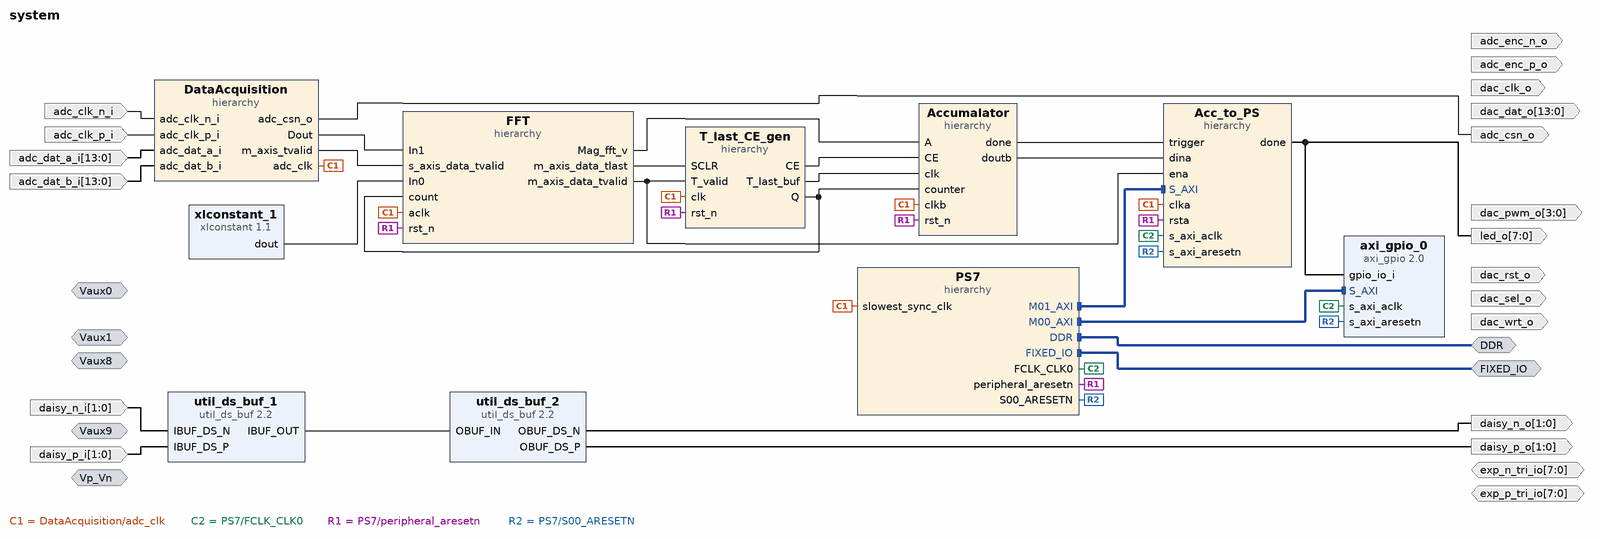
[diagram p0: block diagram of the top level]
# Vivado block design system, xc7z010clg400-1, Vivado 2024.2
create_bd_design system

create_bd_intf_port -mode Slave -vlnv xilinx.com:interface:diff_analog_io_rtl:1.0 Vp_Vn
create_bd_intf_port -mode Slave -vlnv xilinx.com:interface:diff_analog_io_rtl:1.0 Vaux0
create_bd_intf_port -mode Slave -vlnv xilinx.com:interface:diff_analog_io_rtl:1.0 Vaux1
create_bd_intf_port -mode Slave -vlnv xilinx.com:interface:diff_analog_io_rtl:1.0 Vaux9
create_bd_intf_port -mode Slave -vlnv xilinx.com:interface:diff_analog_io_rtl:1.0 Vaux8
create_bd_intf_port -mode Master -vlnv xilinx.com:interface:ddrx_rtl:1.0 DDR
create_bd_intf_port -mode Master -vlnv xilinx.com:display_processing_system7:fixedio_rtl:1.0 FIXED_IO
create_bd_port -dir I -from 13 -to 0 adc_dat_a_i
create_bd_port -dir I -from 13 -to 0 adc_dat_b_i
create_bd_port -dir I adc_clk_p_i
create_bd_port -dir I adc_clk_n_i
create_bd_port -dir O adc_enc_p_o
create_bd_port -dir O adc_enc_n_o
create_bd_port -dir O adc_csn_o
create_bd_port -dir O -from 13 -to 0 dac_dat_o
create_bd_port -dir O dac_clk_o
create_bd_port -dir O dac_rst_o
create_bd_port -dir O dac_sel_o
create_bd_port -dir O dac_wrt_o
create_bd_port -dir O -from 3 -to 0 dac_pwm_o
create_bd_port -dir IO -from 7 -to 0 exp_p_tri_io
create_bd_port -dir IO -from 7 -to 0 exp_n_tri_io
create_bd_port -dir O -from 1 -to 0 daisy_p_o
create_bd_port -dir O -from 1 -to 0 daisy_n_o
create_bd_port -dir I -from 1 -to 0 daisy_p_i
create_bd_port -dir I -from 1 -to 0 daisy_n_i
create_bd_port -dir O -from 7 -to 0 led_o

create_bd_cell -type ip -vlnv xilinx.com:ip:util_ds_buf:2.2 util_ds_buf_1
set_property -dict {CONFIG.C_SIZE 2} [get_bd_cells util_ds_buf_1]
create_bd_cell -type ip -vlnv xilinx.com:ip:util_ds_buf:2.2 util_ds_buf_2
set_property -dict {CONFIG.C_BUF_TYPE OBUFDS CONFIG.C_SIZE 2} [get_bd_cells util_ds_buf_2]
create_bd_cell -type hier PS7
create_bd_cell -type hier DataAcquisition
create_bd_cell -type ip -vlnv xilinx.com:ip:axi_gpio:2.0 axi_gpio_0
set_property -dict {CONFIG.C_ALL_INPUTS 1 CONFIG.C_GPIO_WIDTH 32 CONFIG.C_IS_DUAL 0} [get_bd_cells axi_gpio_0]
create_bd_cell -type ip -vlnv xilinx.com:ip:xlconstant:1.1 xlconstant_1
set_property -dict {CONFIG.CONST_VAL 0 CONFIG.CONST_WIDTH 16} [get_bd_cells xlconstant_1]
create_bd_cell -type hier FFT
create_bd_cell -type hier T_last_CE_gen
create_bd_cell -type hier Accumalator
create_bd_cell -type hier Acc_to_PS

# ---- hierarchy /PS7 ----
current_bd_instance /PS7
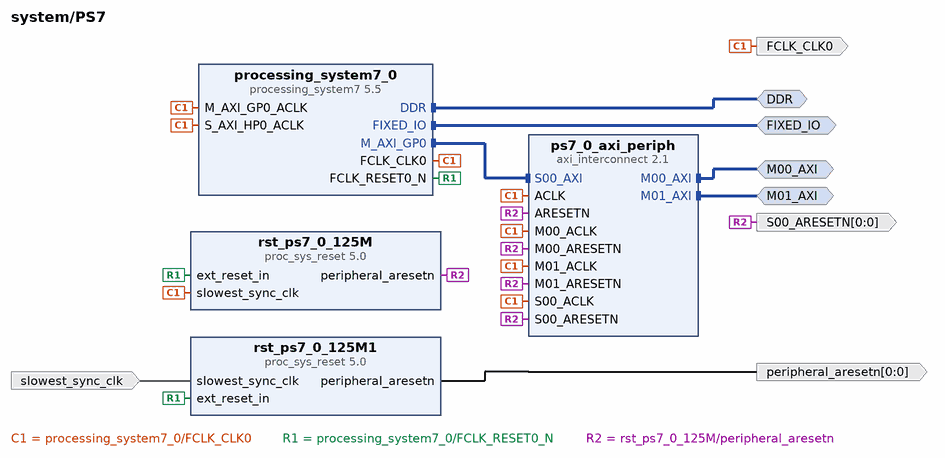
[diagram p1: block diagram inside /PS7]
create_bd_intf_pin -mode Master -vlnv xilinx.com:interface:ddrx_rtl:1.0 DDR
create_bd_intf_pin -mode Master -vlnv xilinx.com:display_processing_system7:fixedio_rtl:1.0 FIXED_IO
create_bd_intf_pin -mode Master -vlnv xilinx.com:interface:aximm_rtl:1.0 M00_AXI
create_bd_intf_pin -mode Master -vlnv xilinx.com:interface:aximm_rtl:1.0 M01_AXI
create_bd_pin -dir O -type clk FCLK_CLK0
create_bd_pin -dir O -from 0 -to 0 -type rst S00_ARESETN
create_bd_pin -dir I -type clk slowest_sync_clk
create_bd_pin -dir O -from 0 -to 0 -type rst peripheral_aresetn

create_bd_cell -type ip -vlnv xilinx.com:ip:processing_system7:5.5 processing_system7_0
set_property -dict [list \
  CONFIG.PCW_APU_PERIPHERAL_FREQMHZ 666.666666 \
  CONFIG.PCW_ENET0_ENET0_IO {MIO 16 .. 27} \
  CONFIG.PCW_ENET0_GRP_MDIO_ENABLE 1 \
  CONFIG.PCW_ENET0_GRP_MDIO_IO EMIO \
  CONFIG.PCW_ENET0_PERIPHERAL_ENABLE 1 \
  CONFIG.PCW_ENET0_RESET_ENABLE 0 \
  CONFIG.PCW_ENET_RESET_ENABLE 1 \
  CONFIG.PCW_ENET_RESET_SELECT {Share reset pin} \
  CONFIG.PCW_FPGA0_PERIPHERAL_FREQMHZ 125 \
  CONFIG.PCW_FPGA1_PERIPHERAL_FREQMHZ 250 \
  CONFIG.PCW_FPGA3_PERIPHERAL_FREQMHZ 200 \
  CONFIG.PCW_GPIO_MIO_GPIO_ENABLE 1 \
  CONFIG.PCW_GPIO_MIO_GPIO_IO MIO \
  CONFIG.PCW_GPIO_PERIPHERAL_ENABLE 1 \
  CONFIG.PCW_I2C0_GRP_INT_ENABLE 0 \
  CONFIG.PCW_I2C0_I2C0_IO {MIO 50 .. 51} \
  CONFIG.PCW_I2C0_PERIPHERAL_ENABLE 1 \
  CONFIG.PCW_I2C_PERIPHERAL_FREQMHZ 111.111115 \
  CONFIG.PCW_I2C_RESET_ENABLE 1 \
  CONFIG.PCW_I2C_RESET_SELECT {Share reset pin} \
  CONFIG.PCW_IMPORT_BOARD_PRESET cfg/red_pitaya.xml \
  CONFIG.PCW_PRESET_BANK1_VOLTAGE {LVCMOS 2.5V} \
  CONFIG.PCW_QSPI_GRP_SINGLE_SS_ENABLE 1 \
  CONFIG.PCW_QSPI_GRP_SINGLE_SS_IO {MIO 1 .. 6} \
  CONFIG.PCW_QSPI_PERIPHERAL_ENABLE 1 \
  CONFIG.PCW_QSPI_PERIPHERAL_FREQMHZ 125 \
  CONFIG.PCW_QSPI_QSPI_IO {MIO 1 .. 6} \
  CONFIG.PCW_SD0_GRP_CD_ENABLE 1 \
  CONFIG.PCW_SD0_GRP_CD_IO {MIO 46} \
  CONFIG.PCW_SD0_GRP_WP_ENABLE 1 \
  CONFIG.PCW_SD0_GRP_WP_IO {MIO 47} \
  CONFIG.PCW_SD0_PERIPHERAL_ENABLE 1 \
  CONFIG.PCW_SD0_SD0_IO {MIO 40 .. 45} \
  CONFIG.PCW_SDIO_PERIPHERAL_FREQMHZ 100 \
  CONFIG.PCW_SINGLE_QSPI_DATA_MODE x4 \
  CONFIG.PCW_SPI0_PERIPHERAL_ENABLE 1 \
  CONFIG.PCW_SPI0_SPI0_IO EMIO \
  CONFIG.PCW_SPI1_PERIPHERAL_ENABLE 1 \
  CONFIG.PCW_SPI1_SPI1_IO {MIO 10 .. 15} \
  CONFIG.PCW_TTC0_PERIPHERAL_ENABLE 1 \
  CONFIG.PCW_TTC0_TTC0_IO EMIO \
  CONFIG.PCW_UART0_PERIPHERAL_ENABLE 1 \
  CONFIG.PCW_UART0_UART0_IO {MIO 14 .. 15} \
  CONFIG.PCW_UART1_PERIPHERAL_ENABLE 1 \
  CONFIG.PCW_UART1_UART1_IO {MIO 8 .. 9} \
  CONFIG.PCW_UART_PERIPHERAL_FREQMHZ 100 \
  CONFIG.PCW_UIPARAM_DDR_BUS_WIDTH {16 Bit} \
  CONFIG.PCW_UIPARAM_DDR_FREQ_MHZ 533.333333 \
  CONFIG.PCW_UIPARAM_DDR_PARTNO {MT41J256M16 RE-125} \
  CONFIG.PCW_USB0_PERIPHERAL_ENABLE 1 \
  CONFIG.PCW_USB0_RESET_ENABLE 1 \
  CONFIG.PCW_USB0_RESET_IO {MIO 48} \
  CONFIG.PCW_USB0_USB0_IO {MIO 28 .. 39} \
  CONFIG.PCW_USB_RESET_ENABLE 1 \
  CONFIG.PCW_USB_RESET_SELECT {Share reset pin} \
  CONFIG.PCW_USE_S_AXI_HP0 1 \
] [get_bd_cells processing_system7_0]
# 429 more settings of processing_system7_0 are not shown: defaults, MIO pin electricals, DDR timing, and values the tool derives
create_bd_cell -type ip -vlnv xilinx.com:ip:proc_sys_reset:5.0 rst_ps7_0_125M
create_bd_cell -type ip -vlnv xilinx.com:ip:axi_interconnect:2.1 ps7_0_axi_periph
set_property -dict {CONFIG.NUM_MI 2} [get_bd_cells ps7_0_axi_periph]
create_bd_cell -type ip -vlnv xilinx.com:ip:proc_sys_reset:5.0 rst_ps7_0_125M1

# ---- hierarchy /DataAcquisition ----
current_bd_instance /DataAcquisition
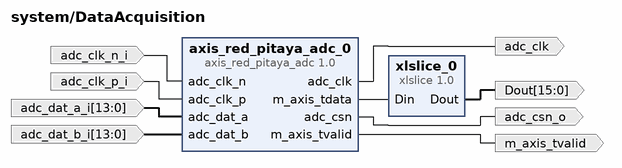
[diagram p2: block diagram inside /DataAcquisition]
create_bd_pin -dir O -type clk adc_clk
create_bd_pin -dir O adc_csn_o
create_bd_pin -dir I adc_clk_p_i
create_bd_pin -dir I adc_clk_n_i
create_bd_pin -dir I -from 13 -to 0 adc_dat_a_i
create_bd_pin -dir I -from 13 -to 0 adc_dat_b_i
create_bd_pin -dir O m_axis_tvalid
create_bd_pin -dir O -from 15 -to 0 Dout

create_bd_cell -type ip -vlnv pavel-demin:user:axis_red_pitaya_adc:1.0 axis_red_pitaya_adc_0
create_bd_cell -type ip -vlnv xilinx.com:ip:xlslice:1.0 xlslice_0
set_property -dict {CONFIG.DIN_FROM 15} [get_bd_cells xlslice_0]

# ---- hierarchy /FFT ----
current_bd_instance /FFT
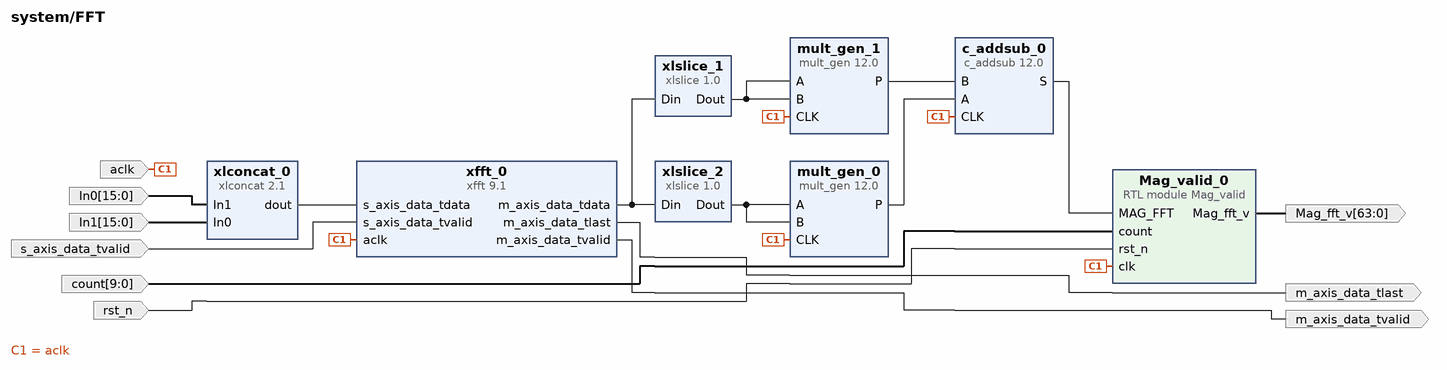
[diagram p3: block diagram inside /FFT]
create_bd_pin -dir I -type clk aclk
create_bd_pin -dir O m_axis_data_tvalid
create_bd_pin -dir O m_axis_data_tlast
create_bd_pin -dir I -from 15 -to 0 In0
create_bd_pin -dir I -type rst rst_n
create_bd_pin -dir I -from 9 -to 0 count
create_bd_pin -dir O -from 63 -to 0 Mag_fft_v
create_bd_pin -dir I s_axis_data_tvalid
create_bd_pin -dir I -from 15 -to 0 In1

create_bd_cell -type ip -vlnv xilinx.com:ip:c_addsub:12.0 c_addsub_0
set_property -dict [list \
  CONFIG.A_Width 64 \
  CONFIG.B_Value 0000000000000000000000000000000000000000000000000000000000000000 \
  CONFIG.B_Width 64 \
  CONFIG.CE false \
  CONFIG.Implementation Fabric \
  CONFIG.Latency 1 \
  CONFIG.Out_Width 64 \
] [get_bd_cells c_addsub_0]
create_bd_cell -type ip -vlnv xilinx.com:ip:mult_gen:12.0 mult_gen_0
set_property -dict [list \
  CONFIG.Multiplier_Construction Use_Mults \
  CONFIG.PortAType Signed \
  CONFIG.PortAWidth 32 \
  CONFIG.PortBType Signed \
  CONFIG.PortBWidth 32 \
] [get_bd_cells mult_gen_0]
create_bd_cell -type ip -vlnv xilinx.com:ip:mult_gen:12.0 mult_gen_1
set_property -dict [list \
  CONFIG.Multiplier_Construction Use_Mults \
  CONFIG.PortAType Signed \
  CONFIG.PortAWidth 32 \
  CONFIG.PortBType Signed \
  CONFIG.PortBWidth 32 \
] [get_bd_cells mult_gen_1]
create_bd_cell -type ip -vlnv xilinx.com:ip:xfft:9.1 xfft_0
set_property -dict [list \
  CONFIG.implementation_options pipelined_streaming_io \
  CONFIG.number_of_stages_using_block_ram_for_data_and_phase_factors 3 \
  CONFIG.output_ordering natural_order \
  CONFIG.scaling_options unscaled \
  CONFIG.target_clock_frequency 125 \
] [get_bd_cells xfft_0]
create_bd_cell -type ip -vlnv xilinx.com:ip:xlconcat:2.1 xlconcat_0
set_property -dict {CONFIG.IN0_WIDTH 16} [get_bd_cells xlconcat_0]
create_bd_cell -type ip -vlnv xilinx.com:ip:xlslice:1.0 xlslice_1
set_property -dict {CONFIG.DIN_FROM 31 CONFIG.DIN_TO 0 CONFIG.DIN_WIDTH 64} [get_bd_cells xlslice_1]
create_bd_cell -type ip -vlnv xilinx.com:ip:xlslice:1.0 xlslice_2
set_property -dict {CONFIG.DIN_FROM 63 CONFIG.DIN_TO 32 CONFIG.DIN_WIDTH 64} [get_bd_cells xlslice_2]
create_bd_cell -type module -reference Mag_valid Mag_valid_0

# ---- hierarchy /T_last_CE_gen ----
current_bd_instance /T_last_CE_gen
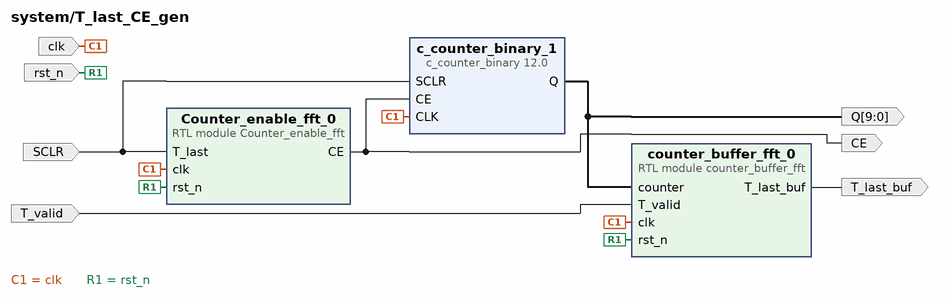
[diagram p4: block diagram inside /T_last_CE_gen]
create_bd_pin -dir I -type rst SCLR
create_bd_pin -dir I -type rst rst_n
create_bd_pin -dir I T_valid
create_bd_pin -dir O -from 9 -to 0 -type data Q
create_bd_pin -dir I -type clk clk
create_bd_pin -dir O CE
create_bd_pin -dir O T_last_buf

create_bd_cell -type module -reference Counter_enable_fft Counter_enable_fft_0
create_bd_cell -type module -reference counter_buffer_fft counter_buffer_fft_0
create_bd_cell -type ip -vlnv xilinx.com:ip:c_counter_binary:12.0 c_counter_binary_1
set_property -dict [list \
  CONFIG.CE true \
  CONFIG.Output_Width 10 \
  CONFIG.SCLR true \
  CONFIG.Sync_CE_Priority CE_Overrides_Sync \
] [get_bd_cells c_counter_binary_1]

# ---- hierarchy /Accumalator ----
current_bd_instance /Accumalator
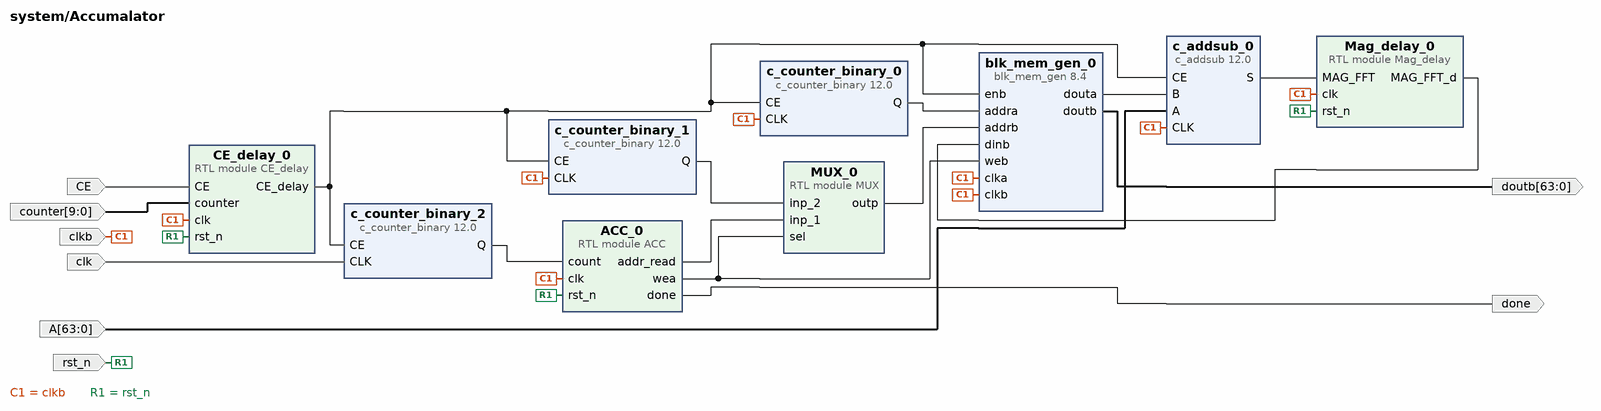
[diagram p5: block diagram inside /Accumalator]
create_bd_pin -dir I -type rst rst_n
create_bd_pin -dir I -type clk clkb
create_bd_pin -dir I -from 63 -to 0 -type data A
create_bd_pin -dir I CE
create_bd_pin -dir I -from 9 -to 0 counter
create_bd_pin -dir I -type clk clk
create_bd_pin -dir O done
create_bd_pin -dir O -from 63 -to 0 doutb

create_bd_cell -type module -reference Mag_delay Mag_delay_0
create_bd_cell -type ip -vlnv xilinx.com:ip:c_addsub:12.0 c_addsub_0
set_property -dict [list \
  CONFIG.A_Type Signed \
  CONFIG.A_Width 64 \
  CONFIG.B_Type Signed \
  CONFIG.B_Value 0000000000000000000000000000000000000000000000000000000000000000 \
  CONFIG.B_Width 64 \
  CONFIG.Latency 1 \
  CONFIG.Out_Width 64 \
] [get_bd_cells c_addsub_0]
create_bd_cell -type ip -vlnv xilinx.com:ip:c_counter_binary:12.0 c_counter_binary_0
set_property -dict {CONFIG.AINIT_Value 1 CONFIG.CE true CONFIG.Output_Width 10} [get_bd_cells c_counter_binary_0]
create_bd_cell -type ip -vlnv xilinx.com:ip:blk_mem_gen:8.4 blk_mem_gen_0
set_property -dict [list \
  CONFIG.Enable_A Always_Enabled \
  CONFIG.Enable_B Use_ENB_Pin \
  CONFIG.Memory_Type True_Dual_Port_RAM \
  CONFIG.Use_RSTA_Pin false \
  CONFIG.Use_RSTB_Pin false \
  CONFIG.Write_Depth_A 1024 \
  CONFIG.Write_Width_A 64 \
  CONFIG.use_bram_block Stand_Alone \
] [get_bd_cells blk_mem_gen_0]
create_bd_cell -type ip -vlnv xilinx.com:ip:c_counter_binary:12.0 c_counter_binary_1
set_property -dict [list \
  CONFIG.AINIT_Value 3FD \
  CONFIG.CE true \
  CONFIG.Output_Width 10 \
  CONFIG.SINIT false \
] [get_bd_cells c_counter_binary_1]
create_bd_cell -type module -reference CE_delay CE_delay_0
create_bd_cell -type module -reference ACC ACC_0
create_bd_cell -type module -reference MUX MUX_0
create_bd_cell -type ip -vlnv xilinx.com:ip:c_counter_binary:12.0 c_counter_binary_2
set_property -dict {CONFIG.CE true CONFIG.Output_Width 12} [get_bd_cells c_counter_binary_2]

# ---- hierarchy /Acc_to_PS ----
current_bd_instance /Acc_to_PS
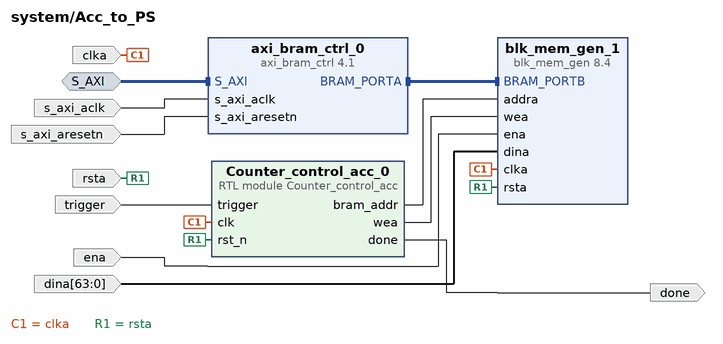
[diagram p6: block diagram inside /Acc_to_PS]
create_bd_intf_pin -mode Slave -vlnv xilinx.com:interface:aximm_rtl:1.0 S_AXI
create_bd_pin -dir I -type clk clka
create_bd_pin -dir I -type rst rsta
create_bd_pin -dir I trigger
create_bd_pin -dir I ena
create_bd_pin -dir I -type clk s_axi_aclk
create_bd_pin -dir I -type rst s_axi_aresetn
create_bd_pin -dir O done
create_bd_pin -dir I -from 63 -to 0 dina

create_bd_cell -type module -reference Counter_control_acc Counter_control_acc_0
create_bd_cell -type ip -vlnv xilinx.com:ip:blk_mem_gen:8.4 blk_mem_gen_1
set_property -dict [list \
  CONFIG.Memory_Type True_Dual_Port_RAM \
  CONFIG.Read_Width_A 64 \
  CONFIG.Write_Width_A 64 \
  CONFIG.use_bram_block BRAM_Controller \
] [get_bd_cells blk_mem_gen_1]
create_bd_cell -type ip -vlnv xilinx.com:ip:axi_bram_ctrl:4.1 axi_bram_ctrl_0
set_property -dict {CONFIG.DATA_WIDTH 64 CONFIG.SINGLE_PORT_BRAM 1} [get_bd_cells axi_bram_ctrl_0]

# ---- connections ----

current_bd_instance /PS7
connect_bd_intf_net [get_bd_intf_pins DDR] [get_bd_intf_pins processing_system7_0/DDR]
connect_bd_intf_net [get_bd_intf_pins FIXED_IO] [get_bd_intf_pins processing_system7_0/FIXED_IO]
connect_bd_intf_net [get_bd_intf_pins processing_system7_0/M_AXI_GP0] [get_bd_intf_pins ps7_0_axi_periph/S00_AXI]
connect_bd_intf_net [get_bd_intf_pins M00_AXI] [get_bd_intf_pins ps7_0_axi_periph/M00_AXI]
connect_bd_intf_net [get_bd_intf_pins M01_AXI] [get_bd_intf_pins ps7_0_axi_periph/M01_AXI]
connect_bd_net [get_bd_pins processing_system7_0/FCLK_CLK0] \
  [get_bd_pins FCLK_CLK0] [get_bd_pins processing_system7_0/S_AXI_HP0_ACLK] [get_bd_pins ps7_0_axi_periph/S00_ACLK] \
  [get_bd_pins rst_ps7_0_125M/slowest_sync_clk] [get_bd_pins ps7_0_axi_periph/M00_ACLK] [get_bd_pins ps7_0_axi_periph/ACLK] \
  [get_bd_pins ps7_0_axi_periph/M01_ACLK] [get_bd_pins processing_system7_0/M_AXI_GP0_ACLK]
connect_bd_net [get_bd_pins processing_system7_0/FCLK_RESET0_N] [get_bd_pins rst_ps7_0_125M/ext_reset_in] [get_bd_pins rst_ps7_0_125M1/ext_reset_in]
connect_bd_net [get_bd_pins rst_ps7_0_125M1/peripheral_aresetn] [get_bd_pins peripheral_aresetn]
connect_bd_net [get_bd_pins rst_ps7_0_125M/peripheral_aresetn] \
  [get_bd_pins S00_ARESETN] [get_bd_pins ps7_0_axi_periph/S00_ARESETN] [get_bd_pins ps7_0_axi_periph/M00_ARESETN] \
  [get_bd_pins ps7_0_axi_periph/ARESETN] [get_bd_pins ps7_0_axi_periph/M01_ARESETN]
connect_bd_net [get_bd_pins slowest_sync_clk] [get_bd_pins rst_ps7_0_125M1/slowest_sync_clk]
set_property HDL_ATTRIBUTE.BMM_INFO_PROCESSOR {arm > system Acc_to_PS/axi_bram_ctrl_0} [get_bd_cells processing_system7_0]
set_property HDL_ATTRIBUTE.KEEP_HIERARCHY yes [get_bd_cells processing_system7_0]

current_bd_instance /DataAcquisition
connect_bd_net [get_bd_pins adc_clk_n_i] [get_bd_pins axis_red_pitaya_adc_0/adc_clk_n]
connect_bd_net [get_bd_pins adc_clk_p_i] [get_bd_pins axis_red_pitaya_adc_0/adc_clk_p]
connect_bd_net [get_bd_pins adc_dat_a_i] [get_bd_pins axis_red_pitaya_adc_0/adc_dat_a]
connect_bd_net [get_bd_pins adc_dat_b_i] [get_bd_pins axis_red_pitaya_adc_0/adc_dat_b]
connect_bd_net [get_bd_pins axis_red_pitaya_adc_0/adc_clk] [get_bd_pins adc_clk]
connect_bd_net [get_bd_pins axis_red_pitaya_adc_0/adc_csn] [get_bd_pins adc_csn_o]
connect_bd_net [get_bd_pins axis_red_pitaya_adc_0/m_axis_tdata] [get_bd_pins xlslice_0/Din]
connect_bd_net [get_bd_pins axis_red_pitaya_adc_0/m_axis_tvalid] [get_bd_pins m_axis_tvalid]
connect_bd_net [get_bd_pins xlslice_0/Dout] [get_bd_pins Dout]

current_bd_instance /FFT
connect_bd_net -net DataAcquisition_adc_clk [get_bd_pins aclk] \
  [get_bd_pins xfft_0/aclk] [get_bd_pins mult_gen_0/CLK] [get_bd_pins mult_gen_1/CLK] [get_bd_pins c_addsub_0/CLK] \
  [get_bd_pins Mag_valid_0/clk]
connect_bd_net -net In0_1 [get_bd_pins In0] [get_bd_pins xlconcat_0/In1]
connect_bd_net -net In1_1 [get_bd_pins In1] [get_bd_pins xlconcat_0/In0]
connect_bd_net [get_bd_pins Mag_valid_0/Mag_fft_v] [get_bd_pins Mag_fft_v]
connect_bd_net [get_bd_pins c_addsub_0/S] [get_bd_pins Mag_valid_0/MAG_FFT]
connect_bd_net -net c_shift_ram_0_Q [get_bd_pins xfft_0/m_axis_data_tdata] [get_bd_pins xlslice_1/Din] [get_bd_pins xlslice_2/Din]
connect_bd_net [get_bd_pins count] [get_bd_pins Mag_valid_0/count]
connect_bd_net [get_bd_pins mult_gen_0/P] [get_bd_pins c_addsub_0/A]
connect_bd_net [get_bd_pins mult_gen_1/P] [get_bd_pins c_addsub_0/B]
connect_bd_net [get_bd_pins rst_n] [get_bd_pins Mag_valid_0/rst_n]
connect_bd_net [get_bd_pins s_axis_data_tvalid] [get_bd_pins xfft_0/s_axis_data_tvalid]
connect_bd_net [get_bd_pins xfft_0/m_axis_data_tlast] [get_bd_pins m_axis_data_tlast]
connect_bd_net [get_bd_pins xfft_0/m_axis_data_tvalid] [get_bd_pins m_axis_data_tvalid]
connect_bd_net [get_bd_pins xlconcat_0/dout] [get_bd_pins xfft_0/s_axis_data_tdata]
connect_bd_net [get_bd_pins xlslice_1/Dout] [get_bd_pins mult_gen_1/A] [get_bd_pins mult_gen_1/B]
connect_bd_net [get_bd_pins xlslice_2/Dout] [get_bd_pins mult_gen_0/B] [get_bd_pins mult_gen_0/A]

current_bd_instance /T_last_CE_gen
connect_bd_net [get_bd_pins Counter_enable_fft_0/CE] [get_bd_pins c_counter_binary_1/CE] [get_bd_pins CE]
connect_bd_net -net FFT_m_axis_data_tlast [get_bd_pins SCLR] [get_bd_pins c_counter_binary_1/SCLR] [get_bd_pins Counter_enable_fft_0/T_last]
connect_bd_net -net FFT_m_axis_data_tvalid [get_bd_pins T_valid] [get_bd_pins counter_buffer_fft_0/T_valid]
connect_bd_net [get_bd_pins clk] [get_bd_pins counter_buffer_fft_0/clk] [get_bd_pins c_counter_binary_1/CLK] [get_bd_pins Counter_enable_fft_0/clk]
connect_bd_net [get_bd_pins c_counter_binary_1/Q] [get_bd_pins counter_buffer_fft_0/counter] [get_bd_pins Q]
connect_bd_net [get_bd_pins counter_buffer_fft_0/T_last_buf] [get_bd_pins T_last_buf]
connect_bd_net [get_bd_pins rst_n] [get_bd_pins counter_buffer_fft_0/rst_n] [get_bd_pins Counter_enable_fft_0/rst_n]

current_bd_instance /Accumalator
connect_bd_net [get_bd_pins ACC_0/addr_read] [get_bd_pins MUX_0/inp_1]
connect_bd_net [get_bd_pins ACC_0/done] [get_bd_pins done]
connect_bd_net [get_bd_pins ACC_0/wea] [get_bd_pins blk_mem_gen_0/web] [get_bd_pins MUX_0/sel]
connect_bd_net [get_bd_pins CE_delay_0/CE_delay] \
  [get_bd_pins c_addsub_0/CE] [get_bd_pins c_counter_binary_0/CE] [get_bd_pins c_counter_binary_1/CE] \
  [get_bd_pins c_counter_binary_2/CE] [get_bd_pins blk_mem_gen_0/enb]
connect_bd_net -net DataAcquisition_adc_clk [get_bd_pins clkb] \
  [get_bd_pins blk_mem_gen_0/clkb] [get_bd_pins blk_mem_gen_0/clka] [get_bd_pins c_addsub_0/CLK] [get_bd_pins CE_delay_0/clk] \
  [get_bd_pins c_counter_binary_0/CLK] [get_bd_pins c_counter_binary_1/CLK] [get_bd_pins Mag_delay_0/clk] \
  [get_bd_pins ACC_0/clk]
connect_bd_net [get_bd_pins MUX_0/outp] [get_bd_pins blk_mem_gen_0/addrb]
connect_bd_net [get_bd_pins Mag_delay_0/MAG_FFT_d] [get_bd_pins blk_mem_gen_0/dinb]
connect_bd_net -net Mag_valid_0_Mag_fft_v [get_bd_pins A] [get_bd_pins c_addsub_0/A]
connect_bd_net -net T_last_CE_gen_CE [get_bd_pins CE] [get_bd_pins CE_delay_0/CE]
connect_bd_net -net T_last_CE_gen_Q [get_bd_pins counter] [get_bd_pins CE_delay_0/counter]
connect_bd_net -net T_last_CE_gen_T_last_buf [get_bd_pins clk] [get_bd_pins c_counter_binary_2/CLK]
connect_bd_net [get_bd_pins blk_mem_gen_0/douta] [get_bd_pins c_addsub_0/B]
connect_bd_net [get_bd_pins blk_mem_gen_0/doutb] [get_bd_pins doutb]
connect_bd_net [get_bd_pins c_addsub_0/S] [get_bd_pins Mag_delay_0/MAG_FFT]
connect_bd_net [get_bd_pins c_counter_binary_0/Q] [get_bd_pins blk_mem_gen_0/addra]
connect_bd_net [get_bd_pins c_counter_binary_1/Q] [get_bd_pins MUX_0/inp_2]
connect_bd_net [get_bd_pins c_counter_binary_2/Q] [get_bd_pins ACC_0/count]
connect_bd_net [get_bd_pins rst_n] [get_bd_pins CE_delay_0/rst_n] [get_bd_pins Mag_delay_0/rst_n] [get_bd_pins ACC_0/rst_n]

current_bd_instance /Acc_to_PS
connect_bd_intf_net [get_bd_intf_pins S_AXI] [get_bd_intf_pins axi_bram_ctrl_0/S_AXI]
connect_bd_intf_net [get_bd_intf_pins axi_bram_ctrl_0/BRAM_PORTA] [get_bd_intf_pins blk_mem_gen_1/BRAM_PORTB]
connect_bd_net -net ACC_0_done [get_bd_pins trigger] [get_bd_pins Counter_control_acc_0/trigger]
connect_bd_net [get_bd_pins Counter_control_acc_0/bram_addr] [get_bd_pins blk_mem_gen_1/addra]
connect_bd_net [get_bd_pins Counter_control_acc_0/done] [get_bd_pins done]
connect_bd_net [get_bd_pins Counter_control_acc_0/wea] [get_bd_pins blk_mem_gen_1/wea]
connect_bd_net -net DataAcquisition_adc_clk [get_bd_pins clka] [get_bd_pins blk_mem_gen_1/clka] [get_bd_pins Counter_control_acc_0/clk]
connect_bd_net -net FFT_m_axis_data_tvalid [get_bd_pins ena] [get_bd_pins blk_mem_gen_1/ena]
connect_bd_net [get_bd_pins dina] [get_bd_pins blk_mem_gen_1/dina]
connect_bd_net -net rst_n_1 [get_bd_pins rsta] [get_bd_pins blk_mem_gen_1/rsta] [get_bd_pins Counter_control_acc_0/rst_n]
connect_bd_net [get_bd_pins s_axi_aclk] [get_bd_pins axi_bram_ctrl_0/s_axi_aclk]
connect_bd_net [get_bd_pins s_axi_aresetn] [get_bd_pins axi_bram_ctrl_0/s_axi_aresetn]
set_property HDL_ATTRIBUTE.BMM_INFO_ADDRESS_SPACE {byte  0x40000000 64 > system Acc_to_PS/blk_mem_gen_1} [get_bd_cells axi_bram_ctrl_0]
set_property HDL_ATTRIBUTE.KEEP_HIERARCHY yes [get_bd_cells axi_bram_ctrl_0]

current_bd_instance /
connect_bd_intf_net [get_bd_intf_pins Acc_to_PS/S_AXI] [get_bd_intf_pins PS7/M01_AXI]
connect_bd_intf_net -intf_net processing_system7_0_DDR [get_bd_intf_ports DDR] [get_bd_intf_pins PS7/DDR]
connect_bd_intf_net -intf_net processing_system7_0_FIXED_IO [get_bd_intf_ports FIXED_IO] [get_bd_intf_pins PS7/FIXED_IO]
connect_bd_intf_net [get_bd_intf_pins PS7/M00_AXI] [get_bd_intf_pins axi_gpio_0/S_AXI]
connect_bd_net -net ACC_0_done [get_bd_pins Accumalator/done] [get_bd_pins Acc_to_PS/trigger]
connect_bd_net -net A_1 [get_bd_pins FFT/Mag_fft_v] [get_bd_pins Accumalator/A]
connect_bd_net [get_bd_pins Accumalator/doutb] [get_bd_pins Acc_to_PS/dina]
connect_bd_net [get_bd_pins DataAcquisition/Dout] [get_bd_pins FFT/In1]
connect_bd_net [get_bd_pins DataAcquisition/adc_clk] \
  [get_bd_pins PS7/slowest_sync_clk] [get_bd_pins T_last_CE_gen/clk] [get_bd_pins Acc_to_PS/clka] \
  [get_bd_pins Accumalator/clkb] [get_bd_pins FFT/aclk]
connect_bd_net [get_bd_pins FFT/m_axis_data_tlast] [get_bd_pins T_last_CE_gen/SCLR]
connect_bd_net [get_bd_pins FFT/m_axis_data_tvalid] [get_bd_pins T_last_CE_gen/T_valid] [get_bd_pins Acc_to_PS/ena]
connect_bd_net [get_bd_pins T_last_CE_gen/CE] [get_bd_pins Accumalator/CE]
connect_bd_net [get_bd_pins T_last_CE_gen/Q] [get_bd_pins Accumalator/counter] [get_bd_pins FFT/count]
connect_bd_net [get_bd_pins T_last_CE_gen/T_last_buf] [get_bd_pins Accumalator/clk]
connect_bd_net [get_bd_ports adc_clk_n_i] [get_bd_pins DataAcquisition/adc_clk_n_i]
connect_bd_net [get_bd_ports adc_clk_p_i] [get_bd_pins DataAcquisition/adc_clk_p_i]
connect_bd_net [get_bd_ports adc_dat_a_i] [get_bd_pins DataAcquisition/adc_dat_a_i]
connect_bd_net [get_bd_ports adc_dat_b_i] [get_bd_pins DataAcquisition/adc_dat_b_i]
connect_bd_net -net axis_red_pitaya_adc_0_adc_csn [get_bd_pins DataAcquisition/adc_csn_o] [get_bd_ports adc_csn_o]
connect_bd_net [get_bd_ports daisy_n_i] [get_bd_pins util_ds_buf_1/IBUF_DS_N]
connect_bd_net [get_bd_ports daisy_p_i] [get_bd_pins util_ds_buf_1/IBUF_DS_P]
connect_bd_net -net processing_system7_0_FCLK_CLK0 [get_bd_pins PS7/FCLK_CLK0] [get_bd_pins axi_gpio_0/s_axi_aclk] [get_bd_pins Acc_to_PS/s_axi_aclk]
connect_bd_net -net rst_n_1 [get_bd_pins PS7/peripheral_aresetn] \
  [get_bd_pins T_last_CE_gen/rst_n] [get_bd_pins Accumalator/rst_n] [get_bd_pins FFT/rst_n] [get_bd_pins Acc_to_PS/rsta]
connect_bd_net -net rst_ps7_0_125M_peripheral_aresetn [get_bd_pins PS7/S00_ARESETN] \
  [get_bd_pins axi_gpio_0/s_axi_aresetn] [get_bd_pins Acc_to_PS/s_axi_aresetn]
connect_bd_net -net s_axis_data_tvalid_1 [get_bd_pins DataAcquisition/m_axis_tvalid] [get_bd_pins FFT/s_axis_data_tvalid]
connect_bd_net -net trigger_1 [get_bd_pins Acc_to_PS/done] [get_bd_pins axi_gpio_0/gpio_io_i] [get_bd_ports led_o]
connect_bd_net [get_bd_pins util_ds_buf_1/IBUF_OUT] [get_bd_pins util_ds_buf_2/OBUF_IN]
connect_bd_net [get_bd_pins util_ds_buf_2/OBUF_DS_N] [get_bd_ports daisy_n_o]
connect_bd_net [get_bd_pins util_ds_buf_2/OBUF_DS_P] [get_bd_ports daisy_p_o]
connect_bd_net [get_bd_pins xlconstant_1/dout] [get_bd_pins FFT/In0]

# ---- address map ----
assign_bd_address -offset 0x40000000 -range 8K -target_address_space [get_bd_addr_spaces PS7/processing_system7_0/Data] [get_bd_addr_segs Acc_to_PS/axi_bram_ctrl_0/S_AXI/Mem0]
assign_bd_address -offset 0x42000000 -range 4K -target_address_space [get_bd_addr_spaces PS7/processing_system7_0/Data] [get_bd_addr_segs axi_gpio_0/S_AXI/Reg]

validate_bd_design
save_bd_design
